# Altium schematic sheet SolarP.SchDoc
size A
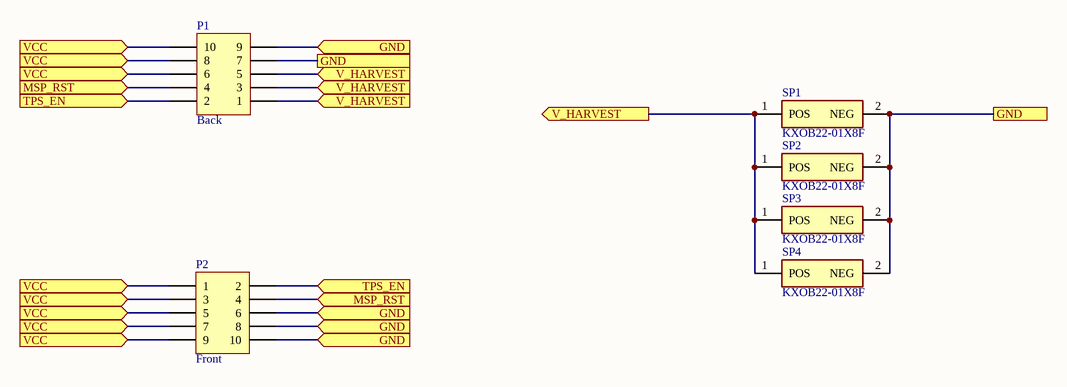
[diagram p0: SolarP.SchDoc]

## Parts
P1  Back  [CLE-105-01-X-DV]
P2  Front  [CLE-105-01-X-DV]
SP1  KXOB22-01X8F  [KXOB22-12X1F]
SP2  KXOB22-01X8F  [KXOB22-12X1F]
SP3  KXOB22-01X8F  [KXOB22-12X1F]
SP4  KXOB22-01X8F  [KXOB22-12X1F]

## Ports
GND, GND (in), MSP_RST (in), TPS_EN (in), V_HARVEST (in), V_HARVEST (out), VCC (in)

## Nets
GND: P1.7 P1.9 P2.6 P2.8 P2.10 SP1.2(NEG) SP2.2(NEG) SP3.2(NEG) SP4.2(NEG) ; port GND
MSP_RST: P1.4 P2.4 ; port MSP_RST
TPS_EN: P1.2 P2.2 ; port TPS_EN
V_HARVEST: P1.1 P1.3 P1.5 SP1.1(POS) SP2.1(POS) SP3.1(POS) SP4.1(POS) ; port V_HARVEST
VCC: P1.6 P1.8 P1.10 P2.1 P2.3 P2.5 P2.7 P2.9 ; port VCC

## Library data of the parts
P1 = Header 5X2: Back board connector; LatestRevisionDate: 17-Jul-2002; LatestRevisionNote: Re-released for DXP Platform.; Publisher: Altium Limited; System: Connector
P2 = Header 5X2: Front board connector; LatestRevisionDate: 17-Jul-2002; LatestRevisionNote: Re-released for DXP Platform.; Publisher: Altium Limited; System: Connector
SP1-SP4 = KXOB22-12X1F: Monocrystalline Solar Cell 22% 2-Pin SMD; Manufacturer_Name: IXYS SEMICONDUCTOR; Datasheet Link: http://ixapps.ixys.com/DataSheet/KXOB22-12X1F_Nov16.pdf; Height: 6.1mm; Manufacturer_Part_Number: KXOB22-12X1F